# EAGLE schematic Flash Trigger Delay (EAGLE 6.2)
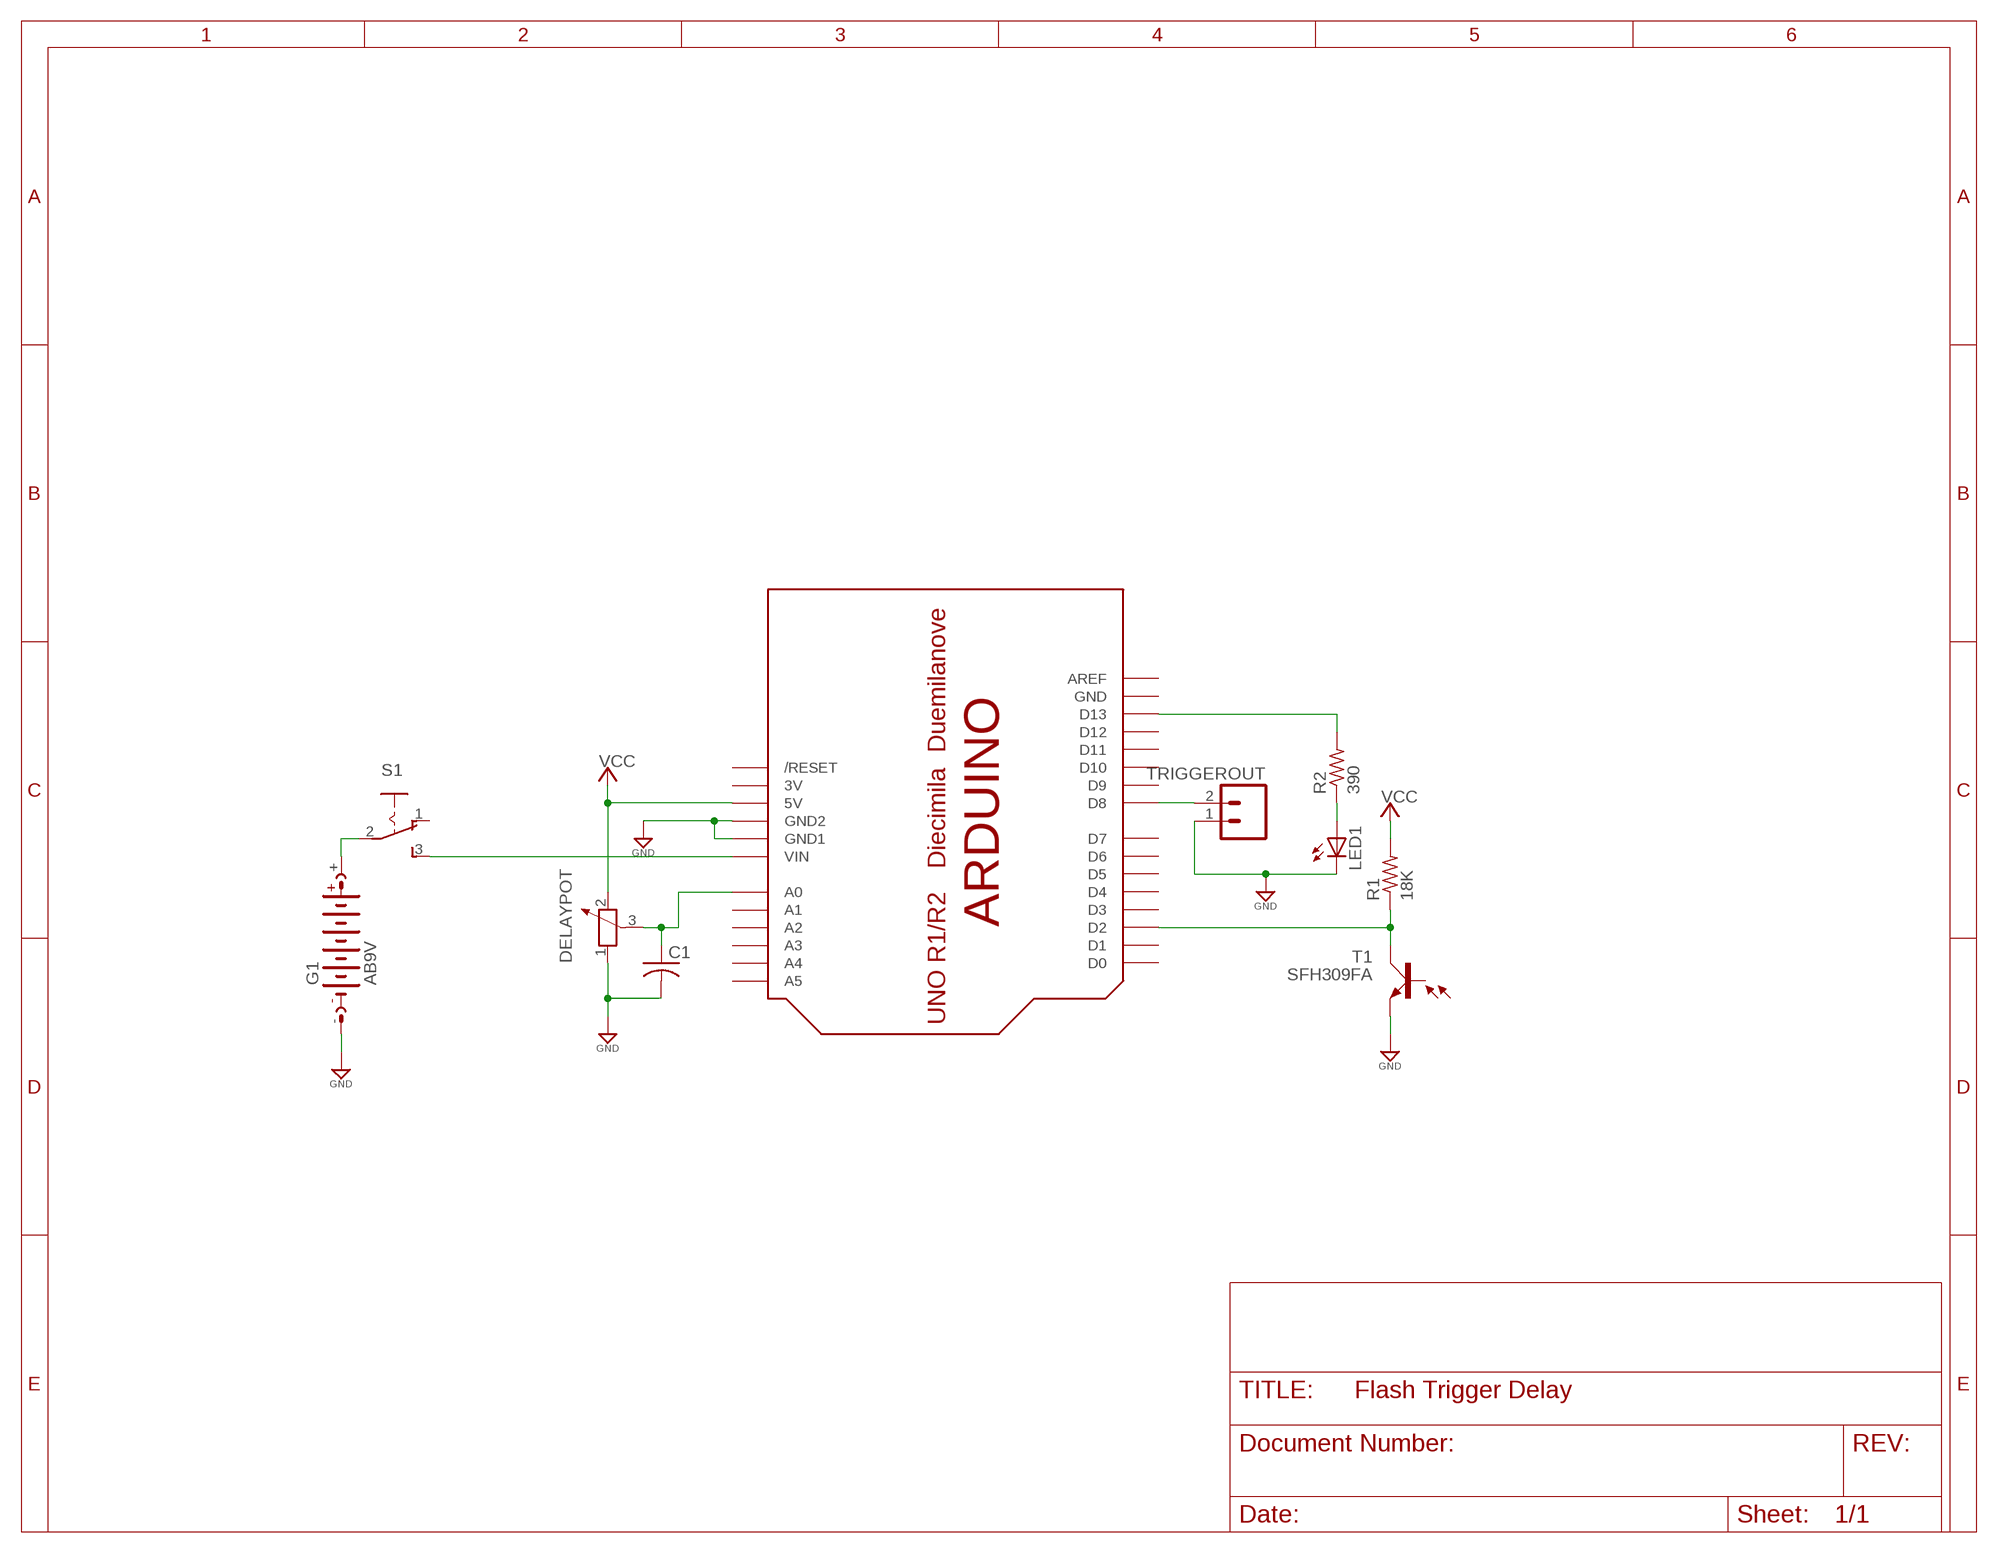
[diagram p0: schematic, sheet 1]

## Parts
C1  C-US050-024X044  [C050-024X044]
DELAYPOT  POTENTIOMETER_PT-10  [PT-10]
G1  AB9V  [AB9V]
LED1  LED3MM  [LED3MM]
R1  18K  R-US_0207/7  [0207/7]
R2  390  R-US_0207/7  [0207/7]
S1  M251  [M251]
T1  SFH309FA  BP103  [BP103]
TRIGGEROUT  M02-0.1  [1X02]
U$1  ARDUINO-BPLACE  [ARDUINO-BPLACE]

## Nets
+3V3: DELAYPOT.2 R1.2 U$1.5V ; supply symbol labelled VCC
GND: C1.2 DELAYPOT.1 G1.- LED1.K(C) T1.E TRIGGEROUT.1 U$1.GND1 U$1.GND2
N$1: G1.+ S1.2(P)
N$2: S1.3(S) U$1.VIN
N$3: C1.1 DELAYPOT.3 U$1.A0
N$4: R1.1 T1.C U$1.D2
N$5: TRIGGEROUT.2 U$1.D8
N$6: R2.2 U$1.D13
N$7: LED1.A R2.1
Unconnected: S1.1(O) T1.B U$1.A1 U$1.A2 U$1.A3 U$1.A4 U$1.A5 U$1.AREF U$1.D0 U$1.D1 U$1.D3 U$1.D4 U$1.D5 U$1.D6 U$1.D7 U$1.D9 U$1.D10 U$1.D11 U$1.D12 U$1.RESET(/RESET)

## Power pins joined to a net without a drawn wire
3V: U$1.3V
GND: U$1.GND

## Library data of the parts
C1 = rcl:C-US: CAPACITOR, American symbol
DELAYPOT = rcl:POTENTIOMETER_: Potentiometer
G1 = battery:AB9V: 9-V BATTERY CLIP
LED1 = adafruit:LED: LED OSRAM: - CHIPLED LG R971, LG N971, LY N971, LG Q971, LY Q971, LO R971, LY R971 LH N974, LH R974 LS Q976, LO Q976, LY Q976 LO Q996 - Hyper CHIPLED LW Q18S LB Q993, LB Q99A, LB R99A - SideLED LS A670, LO A670, LY A670, LG A670, LP A670 LB A673, LV A673, LT A673, LW A673 LH A674 LY A675 LS A676, LA A676, LO A676, LY A676, LW A676 LS A679, LY A679, LG A679 - Hyper Micro SIDELED® LS Y876, LA Y876, LO Y876, LY Y876 LT Y87S - SmartLED LW L88C, LW L88S LB L89C, LB L89S, LG L890 LS L89K, LO L89K, LY L89K LS L896, LA L896, LO L896, LY L896 - TOPLED LS T670, LO T670, LY T670, LG T670, LP T670 LSG T670, LSP T670, LSY T670, LOP T670, LYG T670 LG T671, LOG T671, LSG T671 LB T673, LV T673, LT T673, LW T673 LH T674 LS T676, LA T676, LO T676, LY T676, LB T676, LH T676, LSB T676, LW T676 LB T67C, LV T67C, LT T67C, LS T67K, LO T67K, LY T67K, LW E67C LS E67B, LA E67B, LO E67B, LY E67B, LB E67C, LV E67C, LT E67C LW T67C LS T679, LY T679, LG T679 LS T770, LO T770, LY T770, LG T770, LP T770 LB T773, LV T773, LT T773, LW T773 LH T774 LS E675, LA E675, LY E675, LS T675 LS T776, LA T776, LO T776, LY T776, LB T776 LHGB T686 LT T68C, LB T68C - Hyper Mini TOPLED® LB M676 - Mini TOPLED Santana® LG M470 LS M47K, LO M47K, LY M47K Source: http://www.osram.convergy.de/
R1 R2 = rcl:R-US_: RESISTOR, American symbol
S1 = switch:M251: SLIDING SWITCH Mors, distributor Buerklin, 11G702
T1 = opto-trans-siemens:BP103: PHOTO TRANSISTOR; OC_FARNELL: unknown; OC_NEWARK: unknown
TRIGGEROUT = holla:M02: CONN HEADER 2POS
U$1 = adafruit:ARDUINO: Arduino Diecimila/Duemilanove Make a shield with ease, this package has all the named pins as well as the two mounting drill holes and an outline of the USB and DC power connector. The outline is on the DIMENSION layer, so if your board house uses it they will cut the outline to match. http://www.ladyada.net/library/pcb/eaglelibrary.html